# Altium schematic sheet Структурная схема.SchDoc
size 209 x 144 mm
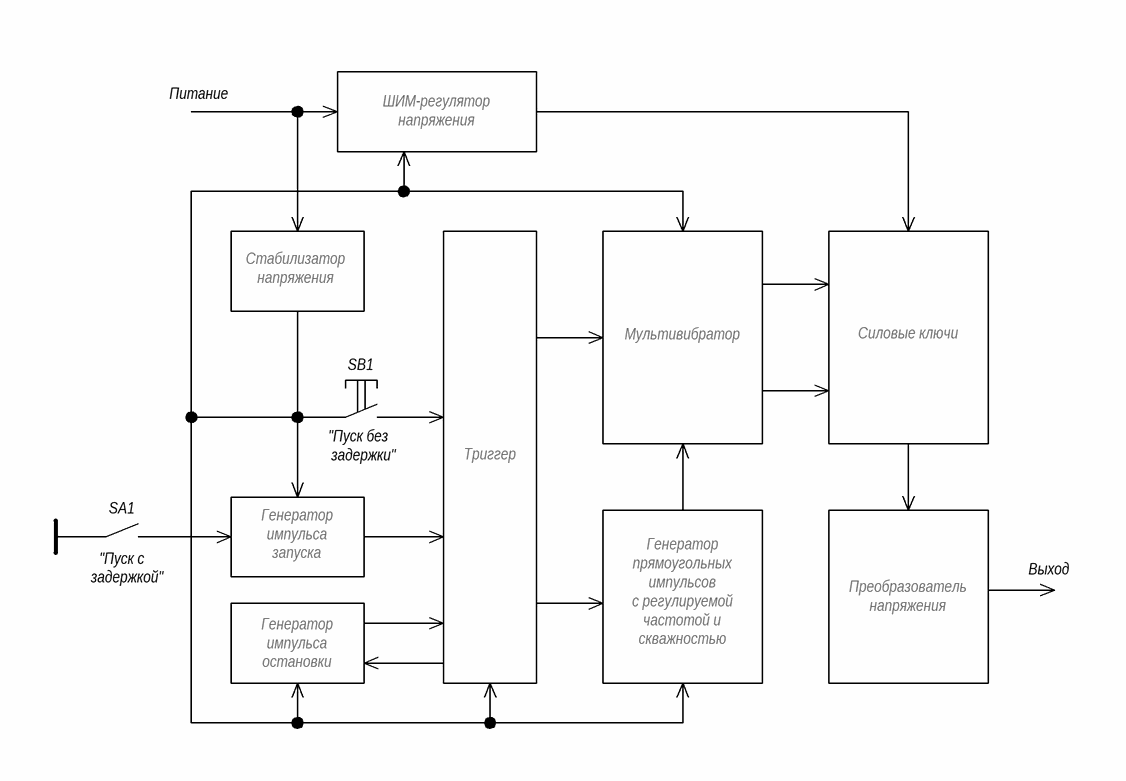
[diagram p0: Структурная схема.SchDoc]

## Notes on the sheet
- Питание
- ШИМ-регулятор
  напряжения
- Стабилизатор
  напряжения
- SB1
- Мультивибратор
- Силовые ключи
- "Пуск без
- задержки"
- Триггер
- SA1
- "Пуск с
- задержкой"
- Генератор
  импульса
  запуска
- Выход
- Генератор
  импульса
  остановки
- Генератор
  прямоугольных импульсов
  с регулируемой
  частотой и скважностью
- Преобразователь
  напряжения